# Altium project ne555.PrjPcb
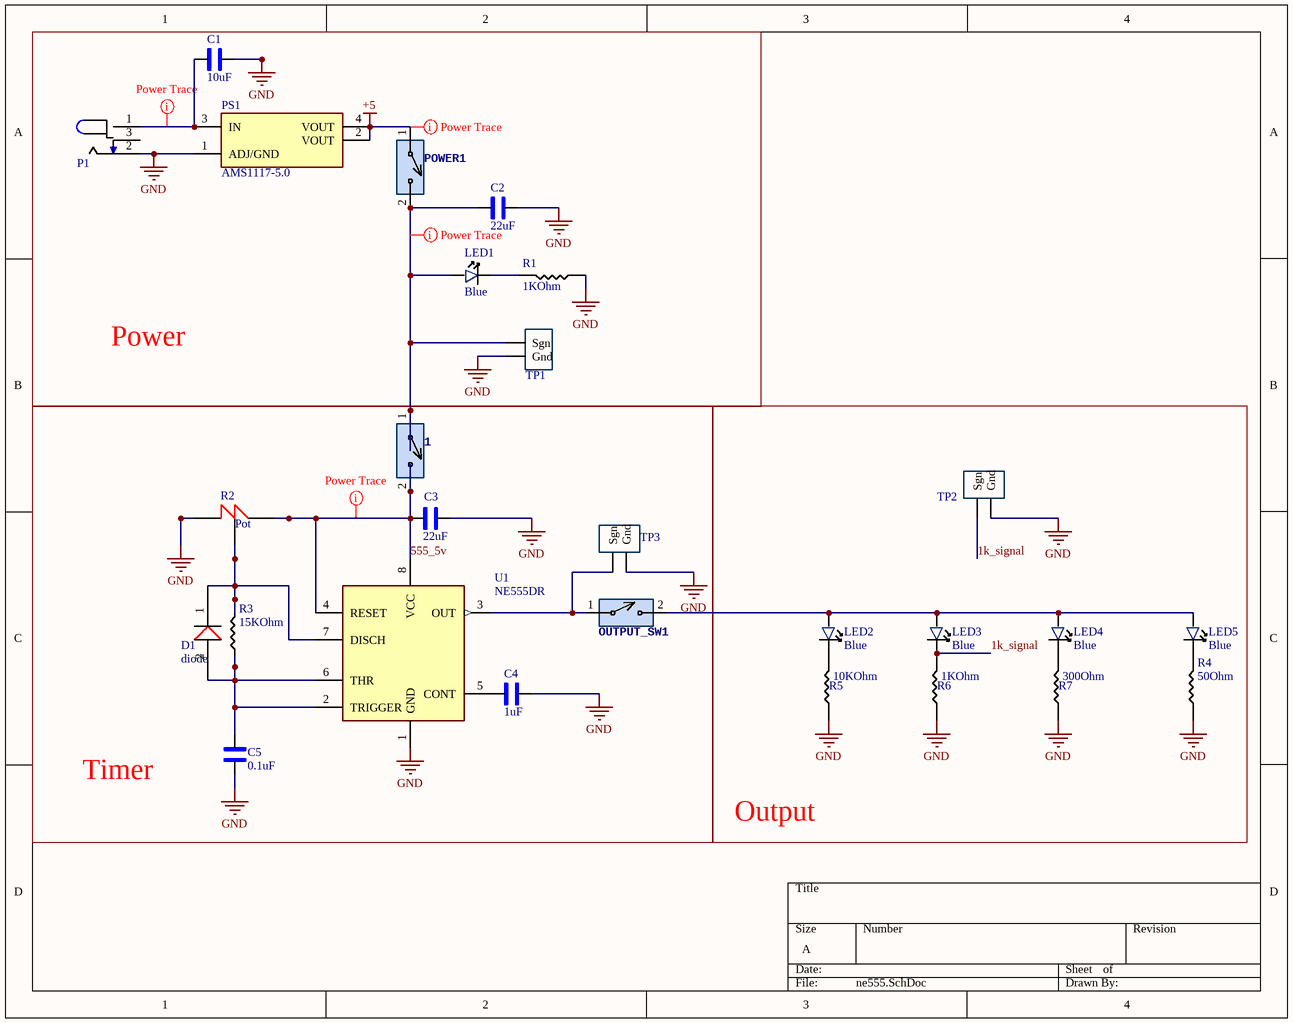
[diagram p0: ne555.SchDoc]
1 sheet, 27 parts. Net scope: global (net labels, ports and power ports of the same name join across sheets).
Board file: ecen5730_board_a.PcbDoc

## Sheet ne555.SchDoc: NE555 Timer
size A; Author: Parth Thakkar; Engineer: Parth Thakkar; Organization: CU Boulder; DocumentNumber: 1; Revision: 1.0; SheetNumber: 1; SheetTotal: 1

### Parts
1  SW_2Pin_100mil_Switch  [2Pin-Header-Conn]  (value not drawn)
C1  10uF  [1206_Passive_Capacitor]
C2  22uF  [1206_Passive_Capacitor]
C3  22uF  [1206_Passive_Capacitor]
C4  1uF  [1206_Passive_Capacitor]
C5  0.1uF  [1206_Passive_Capacitor]
D1  diode  [Through hole diode]
LED1  Blue  [LED_1206]
LED2  Blue  [LED_1206]
LED3  Blue  [LED_1206]
LED4  Blue  [LED_1206]
LED5  Blue  [LED_1206]
OUTPUT_SW1  SW_2Pin_100mil_Switch  [2Pin-Header-Conn]  (value not drawn)
P1  Power Jack  [Power_Jack]  (value not drawn)
POWER1  SW_2Pin_100mil_Switch  [2Pin-Header-Conn]  (value not drawn)
PS1  AMS1117-5.0  [LDO]
R1  1KOhm  [1206_Passive_Resitor]
R2  Pot  [potentiometer]
R3  value 15KOhm  [1206_Passive_Resitor]  (hidden comment: 4.7KOhm)
R4  50Ohm  [1206_Passive_Resitor]
R5  10KOhm  [1206_Passive_Resitor]
R6  1KOhm  [1206_Passive_Resitor]
R7  300Ohm  [1206_Passive_Resitor]
TP1  10x Probe TP  [TP10x_Probe]  (value not drawn)
TP2  LED Test probe  [TP10x_Probe]  (value not drawn)
TP3  10x Probe TP  [TP10x_Probe]  (value not drawn)
U1  NE555DR  [TS555IDTTR]

### Blocks framed on the sheet
Power: C1 C2 LED1 P1 POWER1 PS1 R1 TP1
Timer: 1 C3-C5 D1 OUTPUT_SW1 R2 R3 TP3 U1
Output: LED2-LED5 R4-R7 TP2

### Nets
+5: POWER1.1 PS1.2(VOUT) PS1.4(VOUT)
GND: C1.2 C2.1 C3.1 C4.1 C5.1 P1.2 PS1.1(ADJ/GND) R1.1 R2.1 R4.1 R5.1 R6.1 R7.1 TP1.2(Gnd) TP2.2(Gnd) TP3.2(Gnd) U1.1(GND)
1k_signal: LED3.2 R6.2 TP2.1(Sgn)
555_5v: 1.2 C3.2 R2.2 U1.4(RESET) U1.8(VCC)
Net1_1: 1.1 C2.2 LED1.1 POWER1.2 TP1.1(Sgn)
NetC1_1: C1.1 P1.1 PS1.3(IN)
NetC4_2: C4.2 U1.5(CONT)
NetC5_2: C5.2 D1.2 R3.1 U1.2(TRIGGER) U1.6(THR)
NetD1_1: D1.1 R2.3 R3.2 U1.7(DISCH)
NetLED1_2: LED1.2 R1.2
NetLED2_1: LED2.1 LED3.1 LED4.1 LED5.1 OUTPUT_SW1.2
NetLED2_2: LED2.2 R5.2
NetLED4_2: LED4.2 R7.2
NetLED5_2: LED5.2 R4.2
NetOUTPUT_SW1_1: OUTPUT_SW1.1 TP3.1(Sgn) U1.3(OUT)

Not connected (* = marked no-connect by the designer): P1 3

### Layout directives
rule Width Constraint [Pref Width = 20mil    Min Width = 10mil    Max Width = 100mil]: 555_5v, +5, Net1_1, NetC1_1

### Library data of the parts
1 OUTPUT_SW1 POWER1 = SW_2Pin_100mil_Switch: 2Pin Header; LCSC Part#: C124375; Type: Extended
C1-C5 = C_1uF_1206: MULTILAYER CERAMIC CAPACITORS MLCC - SMD/SMT 1UF 50V 1206 ROHS; MFR Part #: CL31B105KBHNNNE; Type: Basic; Digikey Link: https://www.digikey.com/product-detail/en/C1206C105M4RACTU/399-8150-1-ND/3471873/?itemSeq=304982366; LCSC Part#: C1848
  C1: Value: 10uF
  C2 C3: Value: 22uF
  C4: Value: 1uF
  C5: Value: 0.1uF
LED1-LED5 = LED_BLUE_1206: blue 1206  Light Emitting Diodes (LED) ROHS; MFR Part #: NCD1206B1; Type: Extended; LCSC Part#: C130717; Datasheet: https://datasheet.lcsc.com/lcsc/2008201033_Foshan-NationStar-Optoelectronics-NCD1206B1_C130717.pdf; Value: Blue
P1 = P_Power Jack: Power Barrel Connector Jack 2.10mm ID (0.083"), 5.50mm OD (0.217") Through Hole, Right Angle; MFR Part #: PJ-102A; Value: CONN PWR JACK 2X5.5MM SOLDER; Digikey Link: https://www.digikey.com/product-detail/en/PJ-102A/CP-102A-ND/275425/?itemSeq=304982367; LCSC Part#: C136744; Type: Extended
PS1 = PS_AMS_LDO_5V: LOW DROPOUT REGULATORS(LDO) POSITIVE FIXED 1.3V @ 1A 15V 5V 1A SOT-223 ROHS; Value: IC REG LINEAR 5V 1A SOT223; MFR Part #: AMS1117-5.0; LCSC Part#: C6187; Type: Basic
R1 R6 = R_4.7k_1206: 1kΩ ±1% 0.25W ±100ppm/℃ 1206 Chip Resistor - Surface Mount RoHS; MFR Part #: 1206W4F4701T5E; LCSC Part#: C17936; Datasheet: https://datasheet.lcsc.com/lcsc/1810301414_UNI-ROYAL-Uniroyal-Elec-1206W4F4701T5E_C17936.pdf; Type: Basic; Value: 1KOhm
R2 = Potentiometer: 3 pin potentiometer, Through hole component; Parameter 1: *
R3 R5 = R_4.7k_1206: 4.7kΩ ±1% 0.25W ±100ppm/℃ 1206 Chip Resistor - Surface Mount RoHS; MFR Part #: 1206W4F4701T5E; LCSC Part#: C17936; Datasheet: https://datasheet.lcsc.com/lcsc/1810301414_UNI-ROYAL-Uniroyal-Elec-1206W4F4701T5E_C17936.pdf; Type: Basic
  R5: Value: 10KOhm
R4 = R_4.7k_1206: 50Ω ±1% 0.25W ±100ppm/℃ 1206 Chip Resistor - Surface Mount RoHS; MFR Part #: 1206W4F4701T5E; LCSC Part#: C17936; Datasheet: https://datasheet.lcsc.com/lcsc/1810301414_UNI-ROYAL-Uniroyal-Elec-1206W4F4701T5E_C17936.pdf; Type: Basic; Value: 50Ohm
R7 = R_4.7k_1206: 300Ω ±1% 0.25W ±100ppm/℃ 1206 Chip Resistor - Surface Mount RoHS; MFR Part #: 1206W4F4701T5E; LCSC Part#: C17936; Datasheet: https://datasheet.lcsc.com/lcsc/1810301414_UNI-ROYAL-Uniroyal-Elec-1206W4F4701T5E_C17936.pdf; Type: Basic; Value: 300Ohm
TP1-TP3 = TP_10x_Probe: Test Point 300 mil centers
U1 = U_555_Slow: 555 Timer SOIC-8_150MIL ROHS 150ns Rise Time; MFR Part #: NE555DR; Digikey Link: https://www.digikey.com/product-detail/en/texas-instruments/NE555DR/296-6501-1-ND/372490; Type: Basic; LCSC Part#: C7593